# Altium schematic sheet atmega328p.SchDoc
size A4
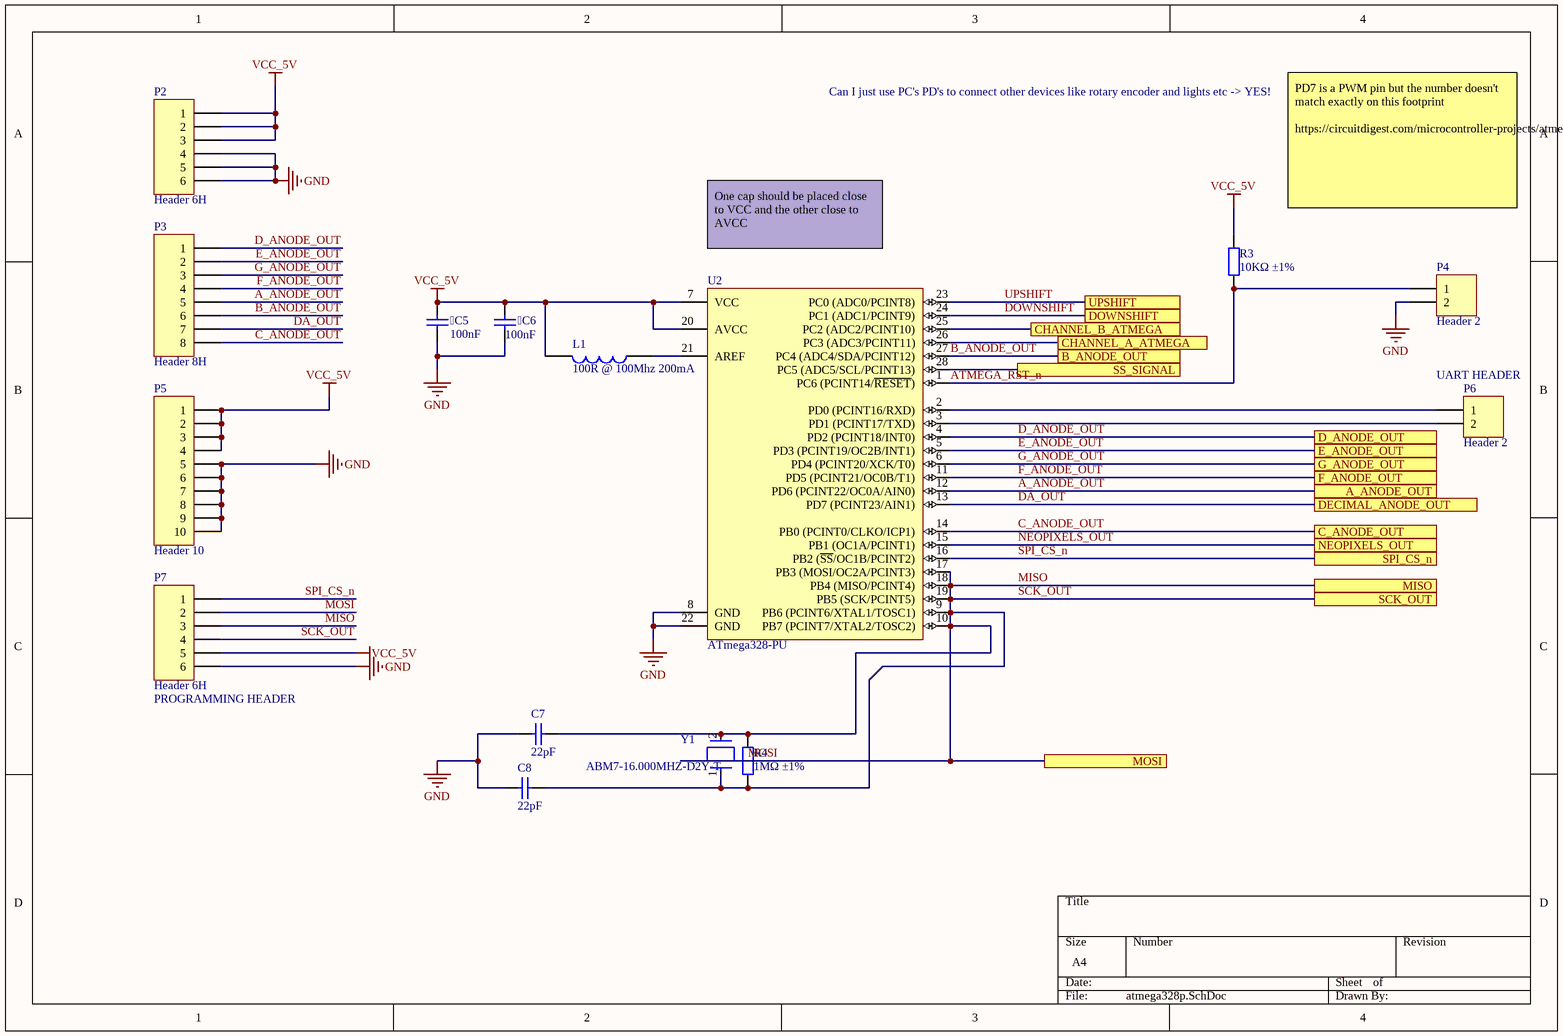
[diagram p0: atmega328p.SchDoc]

## Parts
C5  100nF  [0603_C]
C6  100nF  [0603_C]
C7  22pF  [0603_C]
C8  22pF  [0603_C]
L1  100R @ 100Mhz 200mA  [0603_L]
P2  Header 6H  [HDR1X6H]
P3  Header 8H  [HDR1X8H]
P4  Header 2  [HDR1X2]
P5  Header 10  [HDR1X10]
P6  Header 2  [HDR1X2]
P7  Header 6H  [HDR1X6H]
R3  10KΩ ±1%  [0603_R]
R4  1MΩ ±1%  [0603_R]
U2  ATmega328-PU  [28P3]
Y1  ABM7-16.000MHZ-D2Y-T  [FP-ABM7-MFG]

## Ports
A_ANODE_OUT, B_ANODE_OUT, C_ANODE_OUT, CHANNEL_A_ATMEGA, CHANNEL_B_ATMEGA, D_ANODE_OUT, DECIMAL_ANODE_OUT, DOWNSHIFT, E_ANODE_OUT, F_ANODE_OUT, G_ANODE_OUT, MISO, MOSI, NEOPIXELS_OUT, SCK_OUT, SPI_CS_n, SS_SIGNAL, UPSHIFT

## Nets
GND: C5.1 C6.1 C7.1 C8.1 P2.4 P2.5 P2.6 P4.2 P5.5 P5.6 P5.7 P5.8 P5.9 P5.10 P7.6 U2.8(GND) U2.22(GND)
VCC_5V: C5.2 C6.2 L1.2 P2.1 P2.2 P2.3 P5.1 P5.2 P5.3 P5.4 P7.5 R3.2 U2.7(VCC) U2.20(AVCC)
A_ANODE_OUT: P3.5 U2.12(PD6_(PCINT22/OC0A/AIN0)) ; port A_ANODE_OUT
ATMEGA_RST_n: P4.1 R3.1 U2.1(PC6_(PCINT14/~{RESET}))
B_ANODE_OUT: P3.6 U2.27(PC4_(ADC4/SDA/PCINT12)) ; port B_ANODE_OUT
C_ANODE_OUT: P3.8 U2.14(PB0_(PCINT0/CLKO/ICP1)) ; port C_ANODE_OUT
CHANNEL_A_ATMEGA: U2.26(PC3_(ADC3/PCINT11)) ; port CHANNEL_A_ATMEGA
CHANNEL_B_ATMEGA: U2.25(PC2_(ADC2/PCINT10)) ; port CHANNEL_B_ATMEGA
D_ANODE_OUT: P3.1 U2.4(PD2_(PCINT18/INT0)) ; port D_ANODE_OUT
DA_OUT: P3.7 U2.13(PD7_(PCINT23/AIN1)) ; port DECIMAL_ANODE_OUT
DOWNSHIFT: U2.24(PC1_(ADC1/PCINT9)) ; port DOWNSHIFT
E_ANODE_OUT: P3.2 U2.5(PD3_(PCINT19/OC2B/INT1)) ; port E_ANODE_OUT
F_ANODE_OUT: P3.4 U2.11(PD5_(PCINT21/OC0B/T1)) ; port F_ANODE_OUT
G_ANODE_OUT: P3.3 U2.6(PD4_(PCINT20/XCK/T0)) ; port G_ANODE_OUT
MISO: C7.2 C8.2 P7.2 P7.3 P7.4 R4.1 R4.2 U2.9(PB6_(PCINT6/XTAL1/TOSC1)) U2.10(PB7_(PCINT7/XTAL2/TOSC2)) U2.17(PB3_(MOSI/OC2A/PCINT3)) U2.18(PB4_(MISO/PCINT4)) U2.19(PB5_(SCK/PCINT5)) Y1.1 Y1.2 ; port MISO, port MOSI, port SCK_OUT  [also labelled MOSI, SCK_OUT]
NEOPIXELS_OUT: U2.15(PB1_(OC1A/PCINT1)) ; port NEOPIXELS_OUT
SPI_CS_n: P7.1 U2.16(PB2_(~{SS}/OC1B/PCINT2)) ; port SPI_CS_n
SS_SIGNAL: U2.28(PC5_(ADC5/SCL/PCINT13)) ; port SS_SIGNAL
UPSHIFT: U2.23(PC0_(ADC0/PCINT8)) ; port UPSHIFT
NetL1_1: L1.1 U2.21(AREF)
NetP6_1: P6.1 U2.2(PD0_(PCINT16/RXD))
NetP6_2: P6.2 U2.3(PD1_(PCINT17/TXD))

## Notes on the sheet
- Can I just use PC's PD's to connect other devices like rotary encoder and lights etc -> YES!
- One cap should be placed close to VCC and the other close to AVCC
- PD7 is a PWM pin but the number doesn't match exactly on this footprint
  https://circuitdigest.com/microcontroller-projects/atmega16-32-microcontroller-pwm-tutorial-to-control-brightness-of-led
- (near P6) UART HEADER
- (near P7) PROGRAMMING HEADER

## Library data of the parts
C5 C6 = 0603 100nF (104) 10% 50V: Chip capacitors; Manufacturer: YAGEO; PartNumber: CC0603KRX7R9BB104; Tolerance: 10%; Voltage: 50V; ComponentLink1Description: Supplier link; ComponentLink1URL: http://www.szlcsc.com/product/details_15331.html; Package: 0603; Supplier: LC; SuppliersPartNumber: C14663; Capacitance: 100nF
C7 C8 = 0603 22pF (220) 5% 50V: Chip capacitors; Manufacturer: Samsung Electro-Mechanics; PartNumber: CL10C220JB8NNNC; Tolerance: 5%; Voltage: 50V; ComponentLink1Description: Supplier link; ComponentLink1URL: http://www.szlcsc.com/product/details_2005.html; Package: 0603; Supplier: LC; SuppliersPartNumber: C1653; Capacitance: 22pF
L1 = 0603 100R@100Mhz 0.2A: Ferrite Bead; Notepad: *; Package: 0603; Supplier: LC; SuppliersPartNumber: C98498
P2 P7 = Header 6H: Header, 6-Pin, Right Angle; LatestRevisionDate: 17-Jul-2002; LatestRevisionNote: Re-released for DXP Platform.; Publisher: Altium Limited
P3 = Header 8H: Header, 8-Pin, Right Angle; LatestRevisionDate: 17-Jul-2002; LatestRevisionNote: Re-released for DXP Platform.; Publisher: Altium Limited
P4 P6 = Header 2: Header, 2-Pin; LatestRevisionDate: 17-Jul-2002; LatestRevisionNote: Re-released for DXP Platform.; Publisher: Altium Limited
P5 = Header 10: Header, 10-Pin; LatestRevisionDate: 17-Jul-2002; LatestRevisionNote: Re-released for DXP Platform.; Publisher: Altium Limited
R3 = 0603 10K (1002) 1%: Chip resistor; Manufacturer: Uniroyal Elec; PartNumber: 0603WAF1002T5E; Power: 1/10W; ComponentLink1Description: Supplier link; ComponentLink1URL: http://www.szlcsc.com/product/details_26547.html; Package: 0603; Supplier: LC; SuppliersPartNumber: C25804; Resistance: 10KΩ; Tolerance: 1%
R4 = 0603 1M (1004) 1%: Chip resistor; Manufacturer: Uniroyal Elec; PartNumber: 0603WAF1004T5E; Power: 1/10W; ComponentLink1Description: Supplier link; ComponentLink1URL: http://www.szlcsc.com/product/details_23662.html; Package: 0603; Supplier: LC; SuppliersPartNumber: C22935; Resistance: 1MΩ; Tolerance: 1%
U2 = CMP-0095-00015-2: 8-bit AVR Microcontroller, 32KB Flash, 1KB EEPROM, 2KB SRAM, 28-pin PDIP, Industrial Grade (-40°C to 85°C); ComponentLink3Description: ATmega48A/48PA/88A/88PA/168A/168PA/328/328P Summary; RevisionNote: DatasheetVersion updated. URLs added.; DatasheetVersion: revD, May-2011; ComponentLink1URL: http://www.atmel.com/; PackageVersion: revB, Sep-2001; PackageDescription: 28-lead (0.300"/7.62mm Wide) Plastic Dual Inline Package (PDIP); PackageReference: 28P3; ComponentLink1Description: Manufacturer URL; ComponentLink2Description: ATmega48A/48PA/88A/88PA/168A/168PA/328/328P Datasheet; ComponentLink3URL: http://www.atmel.com/dyn/resources/prod_documents/8271S.pdf; ComponentLink2URL: http://www.atmel.com/dyn/resources/prod_documents/8271.pdf
Y1 = CMP-27762-000095-1: Crystal 16MHz ±20ppm 18pF SMD-2 6mm x 3.5mm; ESR (Equivalent Series Resistance): 50R; Frequency Stability: 30ppm; Width: 3.3mm; Frequency: 16MHz; Radiation Hardening: No; Height: 0.055inch; Tolerance: 20ppm; Length: 6mm; Case/Package: CSMD; Lead Free: Lead Free; Min Operating Temperature: -40°C; Termination: SMD/SMT; Operating Frequency: 16 MHz; Resistor Type: Ceramic; Packaging: Tape and Reel; Mount: Surface Mount; Load Capacitance: 18pF; Frequency Tolerance: 20ppm; Depth: 3.5mm; Series: ABM7; Package Quantity: 1000; Max Operating Temperature: 85°C; Number of Pins: 2